# Altium project Archim_2.0a.PrjPcb (part 2 of 3)

## Sheet Motor-X.SchDoc: Motor-X
size Letter; DocumentNumber: 3; SheetNumber: 5; SheetTotal: 11
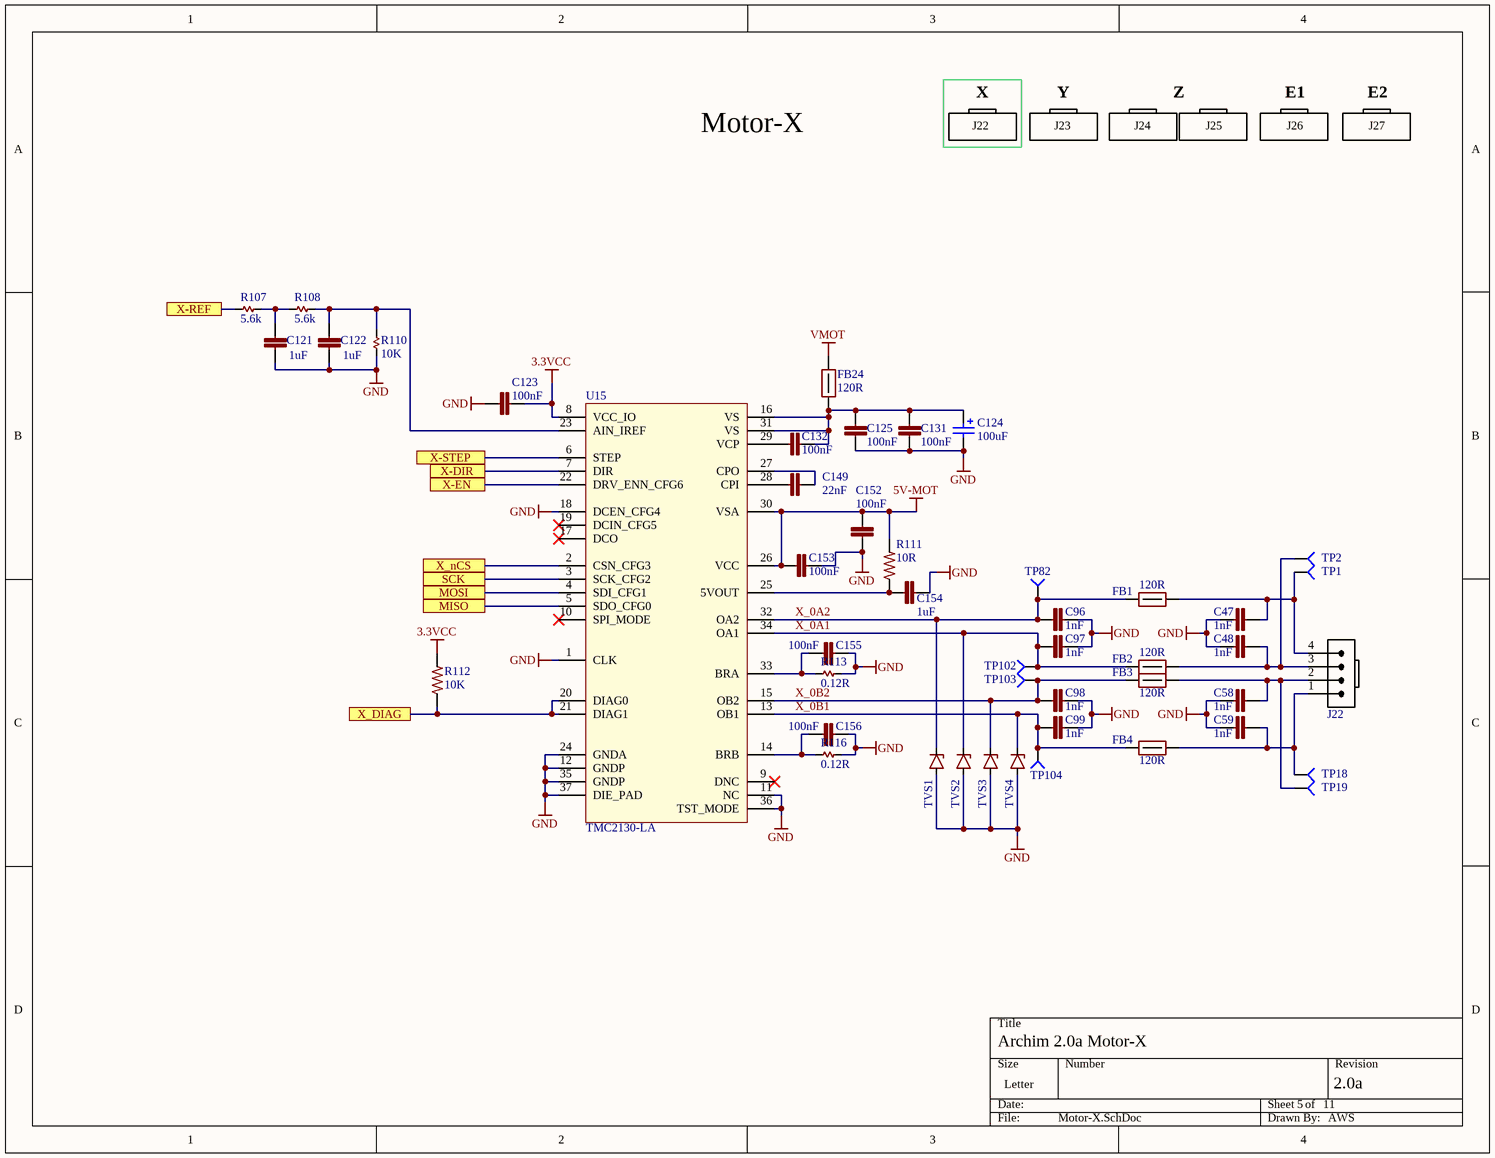
[diagram p6: Motor-X.SchDoc]

### Parts
C47  1nF  [C0402]
C48  1nF  [C0402]
C58  1nF  [C0402]
C59  1nF  [C0402]
C96  1nF  [C0402]
C97  1nF  [C0402]
C98  1nF  [C0402]
C99  1nF  [C0402]
C121  1uF  [C0402]
C122  1uF  [C0402]
C123  100nF  [C0402]
C124  value 100uF  [CAP-ELEC-063063077]  (hidden comment: UWT1V101MCL1GS)
C125  100nF  [C0603]
C131  100nF  [C0603]
C132  100nF  [C0603]
C149  22nF  [C0402]
C152  100nF  [C0402]
C153  100nF  [C0402]
C154  1uF  [C0402]
C155  100nF  [C0603]
C156  100nF  [C0603]
FB1  120R  [FB0603]
FB2  120R  [FB0603]
FB3  120R  [FB0603]
FB4  120R  [FB0603]
FB24  120R  [FB0603]
J22  Molex 0705430038  [4POL254 PIN-IN-PASTE]  (value not drawn)
R107  5.6k  [R0402]
R108  5.6k  [R0402]
R110  10K  [R0402]
R111  10R  [R0402]
R112  10K  [R0402]
R113  0.12R  [R1206]
R116  0.12R  [R1206]
TP1  TP4  [TP-2]  (value not drawn)  (no BOM)
TP2  TP4  [TP-2]  (value not drawn)  (no BOM)
TP18  TP4  [TP-2]  (value not drawn)  (no BOM)
TP19  TP4  [TP-2]  (value not drawn)  (no BOM)
TP82  TP4  [TP-2]  (value not drawn)  (no BOM)
TP102  TP4  [TP-2]  (value not drawn)  (no BOM)
TP103  TP4  [TP-2]  (value not drawn)  (no BOM)
TP104  TP4  [TP-2]  (value not drawn)  (no BOM)
TVS1  TVS 30V SMF  [SMF]  (value not drawn)
TVS2  TVS 30V SMF  [SMF]  (value not drawn)
TVS3  TVS 30V SMF  [SMF]  (value not drawn)
TVS4  TVS 30V SMF  [SMF]  (value not drawn)
U15  TMC2130-LA  [QFN36-50P500X600X900_HS-37N]

### Ports
MISO, MOSI, SCK, X-DIR, X-EN, X-REF, X-STEP, X_DIAG, X_nCS

### Nets
3.3VCC: C123.1 R112.2 U15.8(VCC_IO)
5V-MOT: C152.2 C153.2 R111.2 U15.26(VCC) U15.30(VSA)
GND: C47.1 C48.1 C58.1 C59.1 C96.2 C97.2 C98.2 C99.2 C121.2 C122.2 C123.2 C124.2 C125.1 C131.1 C152.1 C153.1 C154.2 C155.1 C156.1 R110.1 R113.2 R116.2 TVS1.A TVS2.A TVS3.A TVS4.A U15.1(CLK) U15.11(NC) U15.12(GNDP) U15.18(DCEN_CFG4) U15.24(GNDA) U15.35(GNDP) U15.36(TST_MODE) U15.37(DIE_PAD)
VMOT: FB24.2
MISO: U15.5(SDO_CFG0) ; port MISO
MOSI: U15.4(SDI_CFG1) ; port MOSI
SCK: U15.3(SCK_CFG2) ; port SCK
X-DIR: U15.7(DIR) ; port X-DIR
X-EN: U15.22(DRV_ENN_CFG6) ; port X-EN
X-REF: R107.1 ; port X-REF
X-STEP: U15.6(STEP) ; port X-STEP
X_0A1: C97.1 FB2.1 TP102.1 TVS2.K U15.34(OA1)
X_0A2: C96.1 FB1.1 TP82.1 TVS1.K U15.32(OA2)
X_0B1: C99.1 FB4.1 TP104.1 TVS4.K U15.13(OB1)
X_0B2: C98.1 FB3.1 TP103.1 TVS3.K U15.15(OB2)
X_DIAG: R112.1 U15.20(DIAG0) U15.21(DIAG1) ; port X_DIAG
X_nCS: U15.2(CSN_CFG3) ; port X_nCS
NetC47_2: C47.2 FB1.2 J22.4 TP1.1
NetC48_2: C48.2 FB2.2 J22.3 TP2.1
NetC58_2: C58.2 FB3.2 J22.2 TP19.1
NetC59_2: C59.2 FB4.2 J22.1 TP18.1
NetC121_1: C121.1 R107.2 R108.1
NetC122_1: C122.1 R108.2 R110.2 U15.23(AIN_IREF)
NetC124_1: C124.1 C125.2 C131.2 C132.2 FB24.1 U15.16(VS) U15.31(VS)
NetC132_1: C132.1 U15.29(VCP)
NetC149_1: C149.1 U15.28(CPI)
NetC149_2: C149.2 U15.27(CPO)
NetC154_1: C154.1 R111.1 U15.25(5VOUT)
NetC155_2: C155.2 R113.1 U15.33(BRA)
NetC156_2: C156.2 R116.1 U15.14(BRB)

Not connected (* = marked no-connect by the designer): U15 9(DNC)* 10(SPI_MODE)* 17(DCO)* 19(DCIN_CFG5)*

### Notes on the sheet
- X
- Y
- Z
- E1
- E2
- Motor-X
- J22
- J23
- J24
- J25
- J26
- J27

### Library data of the parts
C47 C48 C58 C59 C96-C99 = CAP 1nF 50V 0402 X7R: as C141 on sheet Motor-E1; VALUE: 1nF; DISTRIBUTOR #: 490-1303-2-ND; DISTRIBUTOR: Digi-Key Electronics; EE_SPEC: 50V
C121 C122 = GRM155R60J105KE19D: as C30 on sheet Motor-E1; VALUE: 1uF; MANUFACTURER #: GRM155R60J105KE19D; DISTRIBUTOR #: 490-1320-2-ND; DISTRIBUTOR: Digi-Key Electronics; TOLERANCE: 10%; EE_SPEC: 1uF 6.3V X5R 0402
C123 C152 C153 = GRM155R71C104KA88D: as C85 on sheet Motor-E1; VALUE: 100nF; MANUFACTURER #: GRM155R71C104KA88D; DISTRIBUTOR #: 490-3261-2-ND; DISTRIBUTOR: Digi-Key Electronics; Tolerance: 10%
C124 = UWT1V101MCL1GS: as C87 on sheet Motor-E1; MANUFACTURER #: UWT1V101MCL1GS; DISTRIBUTOR #: 493-2203-2-ND; DISTRIBUTOR: Digi-Key Electronics; Tolerance: 20%
C125 C131 C132 C155 C156 = C0603C104K5RACTU: as C88 on sheet Motor-E1; VALUE: 100nF; MANUFACTURER #: C0603C104K5RACTU; DISTRIBUTOR #: 399-5089-2-ND; DISTRIBUTOR: Digi-Key Electronics; PART: 100nF 50V X7R 0603; Tolerance: 10%
C149 = GCM155R71H223KA55D: as C91 on sheet Motor-E1; VALUE: 22nF; MANUFACTURER #: GCM155R71H223KA55D; DISTRIBUTOR #: 490-4763-2-ND; DISTRIBUTOR: Digi-Key Electronics; PART: 22nF
C154 = GRM155R60J105KE19D: as C102 on sheet Motor-E1; VALUE: 1uF; MANUFACTURER #: GRM155R60J105KE19D; DISTRIBUTOR #: 490-1320-2-ND; DISTRIBUTOR: Digi-Key Electronics; PART: 1uF 6.3V X5R 0402; Tolerance: 10%
FB1-FB4 = FERRITE 120R 3A 0603: as FB26 on sheet Microcontroller; DISTRIBUTOR #: 1276-6351-2-ND; DISTRIBUTOR: Digi-Key Electronics; PART: FERRITE 120R 3A 0603; PART DESCRIPTION: FERRITE BEAD 120 OHM 0603 1LN
FB24 = FERRITE 120R 3A 0603: as FB21 on sheet Motor-E1; DISTRIBUTOR #: 1276-6351-2-ND; DISTRIBUTOR: Digi-Key Electronics; PART: FERRITE 120R 3A 0603; PART DESCRIPTION: FERRITE BEAD 120 OHM 0603 1LN
J22 = Molex 0705430003 PIP: as J26 on sheet Motor-E1
R107 R108 = 5.6k 1% 0402: as R56 on sheet Motor-E1; DISTRIBUTOR #: 311-5.6KLRTR-ND; DISTRIBUTOR: Digi-Key Electronics; PART: RES SMD 5.6K OHM 1% 1/16W 0402; TOLERANCE: 1%; EE_SPEC: 1/16W; VALUE: 5.6k
R110 = 10k 1% 0402: as R58 on sheet Motor-E1; DISTRIBUTOR #: YAG1249TR-ND; DISTRIBUTOR: Digi-Key Electronics; PART: 10k 1% 0402; TOLERANCE: 1%; EE_SPEC: 1/16W; VALUE: 10K
R111 = RC0402FR-0710RL: as R59 on sheet Motor-E1; VALUE: 10R; MANUFACTURER #: RC0402FR-0710RL; DISTRIBUTOR #: 311-10.0LRTR-ND; DISTRIBUTOR: Digi-Key Electronics; PART: 10R; Tolerance: 1%
R112 = RC0402FR-0710KP: as R64 on sheet Microcontroller; VALUE: 10K; MANUFACTURER #: RC0402FR-0710KP; DISTRIBUTOR #: YAG1249TR-ND; DISTRIBUTOR: Digi-Key Electronics; TOLERANCE: 1%; EE_SPEC: 1/16W
R113 R116 = 0.12R 1% 1206: as R84 on sheet Motor-E1; DISTRIBUTOR #: 311-.12LYTR-ND; DISTRIBUTOR: Digi-Key; EE_SPEC: 0.12R 1% 1206; PART: 0.12R; VALUE: 0.12R
TP1 TP2 TP18 TP19 TP82 TP102-TP104 = Socket: MANUFACTURER #: NOTAPART-Testpoint
TVS1-TVS4 = TVS 30V SMF: TVS DIODE 30VWM 48.4VC SMF; MANUFACTURER: Vishay; MANUFACTURER #: SMF30A-E3-08; PART: TVS Diode 48.4VC; TOLERANCE: -NA-; EE_SPEC: 30Vrs 48.4Vc; DISTRIBUTOR #: SMF30A-E3-08GITR-ND; DISTRIBUTOR: Digi-Key Electronics; PART DESCRIPTION: TVS DIODE 30VWM 48.4VC SMF
U15 = TMC2130-LA-T: as U13 on sheet Motor-E1; DISTRIBUTOR #: 1460-1130-2-ND; DISTRIBUTOR: Digi-Key Electronics; MANUFACTURER #: TMC2130-LA-T; PART: TMC2130; VALUE: TMC2130

## Sheet Motor-Y.SchDoc: Motor-Y
size Letter; DocumentNumber: 3; SheetNumber: 6; SheetTotal: 11
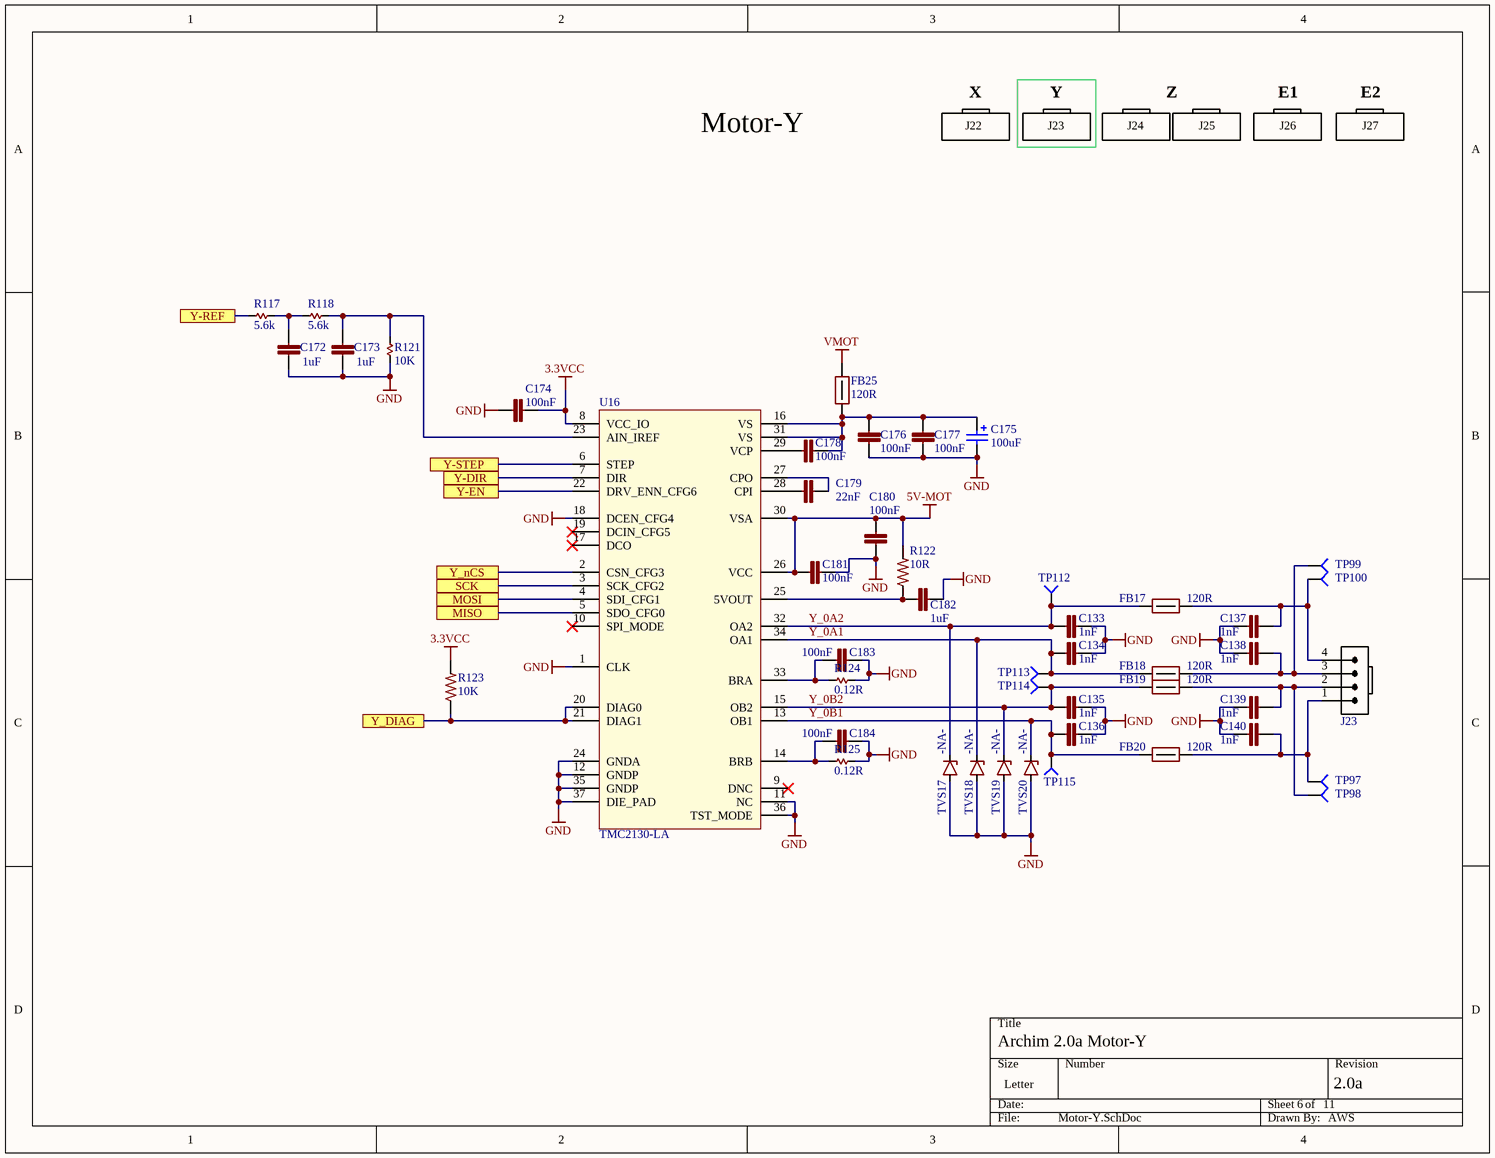
[diagram p7: Motor-Y.SchDoc]

### Parts
C133  1nF  [C0402]
C134  1nF  [C0402]
C135  1nF  [C0402]
C136  1nF  [C0402]
C137  1nF  [C0402]
C138  1nF  [C0402]
C139  1nF  [C0402]
C140  1nF  [C0402]
C172  1uF  [C0402]
C173  1uF  [C0402]
C174  100nF  [C0402]
C175  value 100uF  [CAP-ELEC-063063077]  (hidden comment: UWT1V101MCL1GS)
C176  100nF  [C0603]
C177  100nF  [C0603]
C178  100nF  [C0603]
C179  22nF  [C0402]
C180  100nF  [C0402]
C181  100nF  [C0402]
C182  1uF  [C0402]
C183  100nF  [C0603]
C184  100nF  [C0603]
FB17  120R  [FB0603]
FB18  120R  [FB0603]
FB19  120R  [FB0603]
FB20  120R  [FB0603]
FB25  120R  [FB0603]
J23  Molex 0705430038  [4POL254 PIN-IN-PASTE]  (value not drawn)
R117  5.6k  [R0402]
R118  5.6k  [R0402]
R121  10K  [R0402]
R122  10R  [R0402]
R123  10K  [R0402]
R124  0.12R  [R1206]
R125  0.12R  [R1206]
TP97  TP4  [TP-2]  (value not drawn)  (no BOM)
TP98  TP4  [TP-2]  (value not drawn)  (no BOM)
TP99  TP4  [TP-2]  (value not drawn)  (no BOM)
TP100  TP4  [TP-2]  (value not drawn)  (no BOM)
TP112  TP4  [TP-2]  (value not drawn)  (no BOM)
TP113  TP4  [TP-2]  (value not drawn)  (no BOM)
TP114  TP4  [TP-2]  (value not drawn)  (no BOM)
TP115  TP4  [TP-2]  (value not drawn)  (no BOM)
TVS17  value -NA-  [SMF]  (hidden comment: TVS 30V SMF)
TVS18  value -NA-  [SMF]  (hidden comment: TVS 30V SMF)
TVS19  value -NA-  [SMF]  (hidden comment: TVS 30V SMF)
TVS20  value -NA-  [SMF]  (hidden comment: TVS 30V SMF)
U16  TMC2130-LA  [QFN36-50P500X600X900_HS-37N]

### Ports
MISO, MOSI, SCK, Y-DIR, Y-EN, Y-REF, Y-STEP, Y_DIAG, Y_nCS

### Nets
3.3VCC: C174.1 R123.2 U16.8(VCC_IO)
5V-MOT: C180.2 C181.2 R122.2 U16.26(VCC) U16.30(VSA)
GND: C133.2 C134.2 C135.2 C136.2 C137.2 C138.2 C139.2 C140.2 C172.2 C173.2 C174.2 C175.2 C176.1 C177.1 C180.1 C181.1 C182.2 C183.1 C184.1 R121.1 R124.2 R125.2 TVS17.A TVS18.A TVS19.A TVS20.A U16.1(CLK) U16.11(NC) U16.12(GNDP) U16.18(DCEN_CFG4) U16.24(GNDA) U16.35(GNDP) U16.36(TST_MODE) U16.37(DIE_PAD)
VMOT: FB25.2
MISO: U16.5(SDO_CFG0) ; port MISO
MOSI: U16.4(SDI_CFG1) ; port MOSI
SCK: U16.3(SCK_CFG2) ; port SCK
Y-DIR: U16.7(DIR) ; port Y-DIR
Y-EN: U16.22(DRV_ENN_CFG6) ; port Y-EN
Y-REF: R117.1 ; port Y-REF
Y-STEP: U16.6(STEP) ; port Y-STEP
Y_0A1: C134.1 FB18.1 TP113.1 TVS18.K U16.34(OA1)
Y_0A2: C133.1 FB17.1 TP112.1 TVS17.K U16.32(OA2)
Y_0B1: C136.1 FB20.1 TP115.1 TVS20.K U16.13(OB1)
Y_0B2: C135.1 FB19.1 TP114.1 TVS19.K U16.15(OB2)
Y_DIAG: R123.1 U16.20(DIAG0) U16.21(DIAG1) ; port Y_DIAG
Y_nCS: U16.2(CSN_CFG3) ; port Y_nCS
NetC137_1: C137.1 FB17.2 J23.4 TP100.1
NetC138_1: C138.1 FB18.2 J23.3 TP99.1
NetC139_1: C139.1 FB19.2 J23.2 TP98.1
NetC140_1: C140.1 FB20.2 J23.1 TP97.1
NetC172_1: C172.1 R117.2 R118.1
NetC173_1: C173.1 R118.2 R121.2 U16.23(AIN_IREF)
NetC175_1: C175.1 C176.2 C177.2 C178.2 FB25.1 U16.16(VS) U16.31(VS)
NetC178_1: C178.1 U16.29(VCP)
NetC179_1: C179.1 U16.28(CPI)
NetC179_2: C179.2 U16.27(CPO)
NetC182_1: C182.1 R122.1 U16.25(5VOUT)
NetC183_2: C183.2 R124.1 U16.33(BRA)
NetC184_2: C184.2 R125.1 U16.14(BRB)

Not connected (* = marked no-connect by the designer): U16 9(DNC)* 10(SPI_MODE)* 17(DCO)* 19(DCIN_CFG5)*

### Notes on the sheet
- X
- Y
- Z
- E1
- E2
- Motor-Y
- J22
- J23
- J24
- J25
- J26
- J27

### Library data of the parts
C133-C140 = CAP 1nF 50V 0402 X7R: as C141 on sheet Motor-E1; VALUE: 1nF; DISTRIBUTOR #: 490-1303-2-ND; DISTRIBUTOR: Digi-Key Electronics; EE_SPEC: 50V
C172 C173 = GRM155R60J105KE19D: as C30 on sheet Motor-E1; VALUE: 1uF; MANUFACTURER #: GRM155R60J105KE19D; DISTRIBUTOR #: 490-1320-2-ND; DISTRIBUTOR: Digi-Key Electronics; TOLERANCE: 10%; EE_SPEC: 1uF 6.3V X5R 0402
C174 C180 C181 = GRM155R71C104KA88D: as C85 on sheet Motor-E1; VALUE: 100nF; MANUFACTURER #: GRM155R71C104KA88D; DISTRIBUTOR #: 490-3261-2-ND; DISTRIBUTOR: Digi-Key Electronics; Tolerance: 10%
C175 = UWT1V101MCL1GS: as C87 on sheet Motor-E1; MANUFACTURER #: UWT1V101MCL1GS; DISTRIBUTOR #: 493-2203-2-ND; DISTRIBUTOR: Digi-Key Electronics; Tolerance: 20%
C176-C178 C183 C184 = C0603C104K5RACTU: as C88 on sheet Motor-E1; VALUE: 100nF; MANUFACTURER #: C0603C104K5RACTU; DISTRIBUTOR #: 399-5089-2-ND; DISTRIBUTOR: Digi-Key Electronics; PART: 100nF 50V X7R 0603; Tolerance: 10%
C179 = GCM155R71H223KA55D: as C91 on sheet Motor-E1; VALUE: 22nF; MANUFACTURER #: GCM155R71H223KA55D; DISTRIBUTOR #: 490-4763-2-ND; DISTRIBUTOR: Digi-Key Electronics; PART: 22nF
C182 = GRM155R60J105KE19D: as C102 on sheet Motor-E1; VALUE: 1uF; MANUFACTURER #: GRM155R60J105KE19D; DISTRIBUTOR #: 490-1320-2-ND; DISTRIBUTOR: Digi-Key Electronics; PART: 1uF 6.3V X5R 0402; Tolerance: 10%
FB17-FB20 = FERRITE 120R 3A 0603: as FB26 on sheet Microcontroller; DISTRIBUTOR #: 1276-6351-2-ND; DISTRIBUTOR: Digi-Key Electronics; PART: FERRITE 120R 3A 0603; PART DESCRIPTION: FERRITE BEAD 120 OHM 0603 1LN
FB25 = FERRITE 120R 3A 0603: as FB21 on sheet Motor-E1; DISTRIBUTOR #: 1276-6351-2-ND; DISTRIBUTOR: Digi-Key Electronics; PART: FERRITE 120R 3A 0603; PART DESCRIPTION: FERRITE BEAD 120 OHM 0603 1LN
J23 = Molex 0705430003 PIP: as J26 on sheet Motor-E1
R117 R118 = 5.6k 1% 0402: as R56 on sheet Motor-E1; DISTRIBUTOR #: 311-5.6KLRTR-ND; DISTRIBUTOR: Digi-Key Electronics; PART: RES SMD 5.6K OHM 1% 1/16W 0402; TOLERANCE: 1%; EE_SPEC: 1/16W; VALUE: 5.6k
R121 = 10k 1% 0402: as R58 on sheet Motor-E1; DISTRIBUTOR #: YAG1249TR-ND; DISTRIBUTOR: Digi-Key Electronics; PART: 10k 1% 0402; TOLERANCE: 1%; EE_SPEC: 1/16W; VALUE: 10K
R122 = RC0402FR-0710RL: as R59 on sheet Motor-E1; VALUE: 10R; MANUFACTURER #: RC0402FR-0710RL; DISTRIBUTOR #: 311-10.0LRTR-ND; DISTRIBUTOR: Digi-Key Electronics; PART: 10R; Tolerance: 1%
R123 = RC0402FR-0710KP: as R64 on sheet Microcontroller; VALUE: 10K; MANUFACTURER #: RC0402FR-0710KP; DISTRIBUTOR #: YAG1249TR-ND; DISTRIBUTOR: Digi-Key Electronics; TOLERANCE: 1%; EE_SPEC: 1/16W
R124 R125 = 0.12R 1% 1206: as R84 on sheet Motor-E1; DISTRIBUTOR #: 311-.12LYTR-ND; DISTRIBUTOR: Digi-Key; EE_SPEC: 0.12R 1% 1206; PART: 0.12R; VALUE: 0.12R
TP97-TP100 TP112-TP115 = Socket: MANUFACTURER #: NOTAPART-Testpoint
TVS17-TVS20 = TVS 30V SMF: as TVS13 on sheet Motor-E1; DISTRIBUTOR #: SMF30A-E3-08GITR-ND; DISTRIBUTOR: Digi-Key Electronics; PART DESCRIPTION: TVS DIODE 30VWM 48.4VC SMF; TOLERANCE: -NA-
U16 = TMC2130-LA-T: as U13 on sheet Motor-E1; DISTRIBUTOR #: 1460-1130-2-ND; DISTRIBUTOR: Digi-Key Electronics; MANUFACTURER #: TMC2130-LA-T; PART: TMC2130; VALUE: TMC2130

## Sheet Motor-Z.SchDoc: Motor-Z
size Letter; DocumentNumber: 4; SheetNumber: 7; SheetTotal: 11
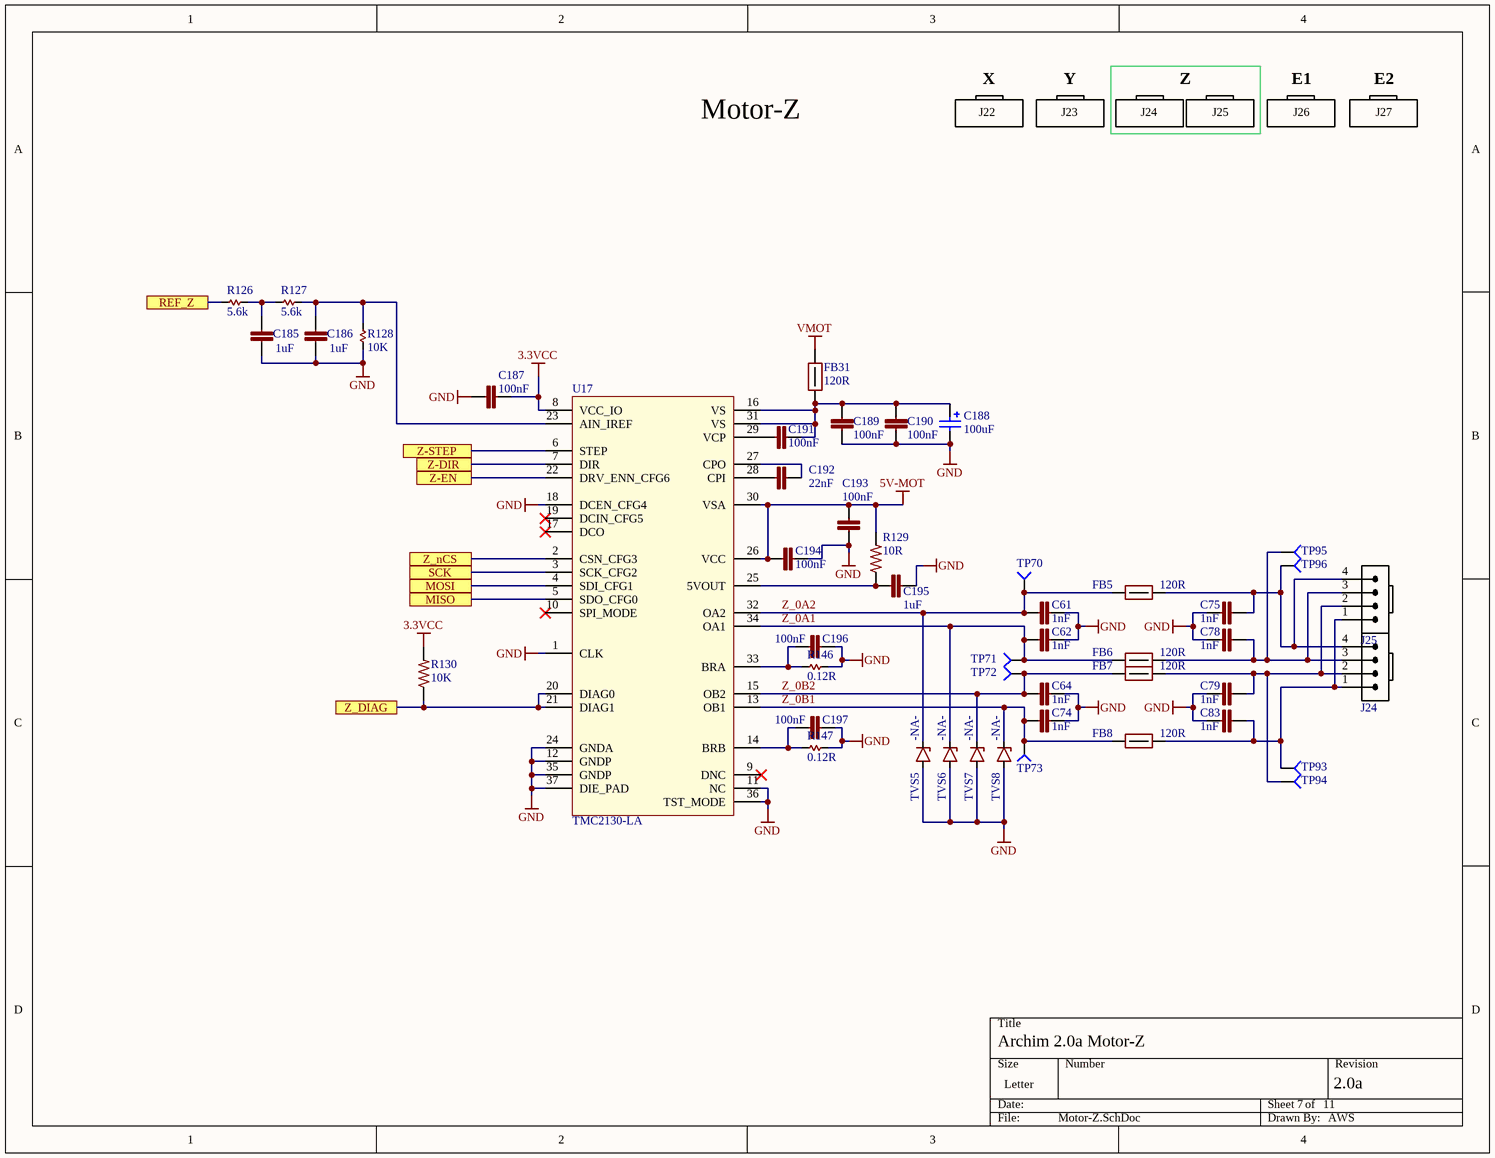
[diagram p8: Motor-Z.SchDoc]

### Parts
C61  1nF  [C0402]
C62  1nF  [C0402]
C64  1nF  [C0402]
C74  1nF  [C0402]
C75  1nF  [C0402]
C78  1nF  [C0402]
C79  1nF  [C0402]
C83  1nF  [C0402]
C185  1uF  [C0402]
C186  1uF  [C0402]
C187  100nF  [C0402]
C188  value 100uF  [CAP-ELEC-063063077]  (hidden comment: UWT1V101MCL1GS)
C189  100nF  [C0603]
C190  100nF  [C0603]
C191  100nF  [C0603]
C192  22nF  [C0402]
C193  100nF  [C0402]
C194  100nF  [C0402]
C195  1uF  [C0402]
C196  100nF  [C0603]
C197  100nF  [C0603]
FB5  120R  [FB0603]
FB6  120R  [FB0603]
FB7  120R  [FB0603]
FB8  120R  [FB0603]
FB31  120R  [FB0603]
J24  Molex 0705430038  [4POL254 PIN-IN-PASTE]  (value not drawn)
J25  Molex 0705430038  [4POL254 PIN-IN-PASTE]  (value not drawn)
R126  5.6k  [R0402]
R127  5.6k  [R0402]
R128  10K  [R0402]
R129  10R  [R0402]
R130  10K  [R0402]
R146  0.12R  [R1206]
R147  0.12R  [R1206]
TP70  TP4  [TP-2]  (value not drawn)  (no BOM)
TP71  TP4  [TP-2]  (value not drawn)  (no BOM)
TP72  TP4  [TP-2]  (value not drawn)  (no BOM)
TP73  TP4  [TP-2]  (value not drawn)  (no BOM)
TP93  TP4  [TP-2]  (value not drawn)  (no BOM)
TP94  TP4  [TP-2]  (value not drawn)  (no BOM)
TP95  TP4  [TP-2]  (value not drawn)  (no BOM)
TP96  TP4  [TP-2]  (value not drawn)  (no BOM)
TVS5  value -NA-  [SMF]  (hidden comment: TVS 30V SMF)
TVS6  value -NA-  [SMF]  (hidden comment: TVS 30V SMF)
TVS7  value -NA-  [SMF]  (hidden comment: TVS 30V SMF)
TVS8  value -NA-  [SMF]  (hidden comment: TVS 30V SMF)
U17  TMC2130-LA  [QFN36-50P500X600X900_HS-37N]

### Ports
MISO, MOSI, REF_Z, SCK, Z-DIR, Z-EN, Z-STEP, Z_DIAG, Z_nCS

### Nets
3.3VCC: C187.1 R130.2 U17.8(VCC_IO)
5V-MOT: C193.2 C194.2 R129.2 U17.26(VCC) U17.30(VSA)
GND: C61.2 C62.2 C64.2 C74.2 C75.1 C78.1 C79.1 C83.1 C185.2 C186.2 C187.2 C188.2 C189.1 C190.1 C193.1 C194.1 C195.2 C196.1 C197.1 R128.1 R146.2 R147.2 TVS5.A TVS6.A TVS7.A TVS8.A U17.1(CLK) U17.11(NC) U17.12(GNDP) U17.18(DCEN_CFG4) U17.24(GNDA) U17.35(GNDP) U17.36(TST_MODE) U17.37(DIE_PAD)
VMOT: FB31.2
MISO: U17.5(SDO_CFG0) ; port MISO
MOSI: U17.4(SDI_CFG1) ; port MOSI
REF_Z: R126.1 ; port REF_Z
SCK: U17.3(SCK_CFG2) ; port SCK
Z-DIR: U17.7(DIR) ; port Z-DIR
Z-EN: U17.22(DRV_ENN_CFG6) ; port Z-EN
Z-STEP: U17.6(STEP) ; port Z-STEP
Z_0A1: C62.1 FB6.1 TP71.1 TVS6.K U17.34(OA1)
Z_0A2: C61.1 FB5.1 TP70.1 TVS5.K U17.32(OA2)
Z_0B1: C74.1 FB8.1 TP73.1 TVS8.K U17.13(OB1)
Z_0B2: C64.1 FB7.1 TP72.1 TVS7.K U17.15(OB2)
Z_DIAG: R130.1 U17.20(DIAG0) U17.21(DIAG1) ; port Z_DIAG
Z_nCS: U17.2(CSN_CFG3) ; port Z_nCS
NetC75_2: C75.2 FB5.2 J24.4 J25.4 TP96.1
NetC78_2: C78.2 FB6.2 J24.3 J25.3 TP95.1
NetC79_2: C79.2 FB7.2 J24.2 J25.2 TP94.1
NetC83_2: C83.2 FB8.2 J24.1 J25.1 TP93.1
NetC185_1: C185.1 R126.2 R127.1
NetC186_1: C186.1 R127.2 R128.2 U17.23(AIN_IREF)
NetC188_1: C188.1 C189.2 C190.2 C191.2 FB31.1 U17.16(VS) U17.31(VS)
NetC191_1: C191.1 U17.29(VCP)
NetC192_1: C192.1 U17.28(CPI)
NetC192_2: C192.2 U17.27(CPO)
NetC195_1: C195.1 R129.1 U17.25(5VOUT)
NetC196_2: C196.2 R146.1 U17.33(BRA)
NetC197_2: C197.2 R147.1 U17.14(BRB)

Not connected (* = marked no-connect by the designer): U17 9(DNC)* 10(SPI_MODE)* 17(DCO)* 19(DCIN_CFG5)*

### Notes on the sheet
- X
- Y
- Z
- E1
- E2
- Motor-Z
- J22
- J23
- J24
- J25
- J26
- J27

### Library data of the parts
C61 C62 C64 C74 C75 C78 C79 C83 = CAP 1nF 50V 0402 X7R: 1000pF 50V Ceramic Capacitor X7R 0402 (1005 Metric) 0.039" L x 0.020" W (1.00mm x 0.50mm); MANUFACTURER: Murata; MANUFACTURER #: GRM155R71H102KA01D; PART: 1nF 50V X7R 0402; PART DESCRIPTION: 1000pF ±10% 50V Ceramic Capacitor X7R 0402 (1005 Metric); TOLERANCE: 10%; VALUE: 1nF; DISTRIBUTOR #: 490-1303-2-ND; DISTRIBUTOR: Digi-Key Electronics; EE_SPEC: 50V
C185 C186 = GRM155R60J105KE19D: CAP CER 0402 1uF 6.3V 10% X5R; MANUFACTURER: Murata; PART: 1uF 6.3V X5R 0402; PART DESCRIPTION: 1µF ±10% 6.3V Ceramic Capacitor X5R 0402 (1005 Metric); VALUE: 1uF; MANUFACTURER #: GRM155R60J105KE19D; DISTRIBUTOR #: 490-1320-2-ND; DISTRIBUTOR: Digi-Key Electronics; TOLERANCE: 10%; EE_SPEC: 1uF 6.3V X5R 0402
C187 C193 C194 = GRM155R71C104KA88D: CAP CER 0402 100nF 16V 10% X7R; Manufacturer: Murata; PART: 0.1uF 16V X7R 0402; Part Description: 0.10µF ±10% 16V Ceramic Capacitor X7R 0402 (1005 Metric); EE_SPEC: 100nF 16V X7R 0402; VALUE: 100nF; MANUFACTURER #: GRM155R71C104KA88D; DISTRIBUTOR #: 490-3261-2-ND; DISTRIBUTOR: Digi-Key Electronics; Tolerance: 10%
C188 = UWT1V101MCL1GS: CAP ALUM 100UF 35V 20% SMD; Manufacturer: Nichicon; PART: 100uF 35V SMD Al-El; Part Description: 100µF 35V Aluminum Capacitors Radial, Can - SMD 1000 Hrs @ 105°C; EE_SPEC: 100uF 35V Al-El; MANUFACTURER #: UWT1V101MCL1GS; DISTRIBUTOR #: 493-2203-2-ND; DISTRIBUTOR: Digi-Key Electronics; Tolerance: 20%
C189-C191 C196 C197 = C0603C104K5RACTU: CAP CER 0603 100nF 50V 10% X7R; Manufacturer: Kemet; Part Description: 0.1µF ±10% 50V Ceramic Capacitor X7R 0603 (1608 Metric); EE_SPEC: 100nF 50V X7R 0603; VALUE: 100nF; MANUFACTURER #: C0603C104K5RACTU; DISTRIBUTOR #: 399-5089-2-ND; DISTRIBUTOR: Digi-Key Electronics; PART: 100nF 50V X7R 0603; Tolerance: 10%
C192 = GCM155R71H223KA55D: CAP CER 0402 22nF ±10% 50V X7R; Manufacturer: YAGEO; Part Description: 0.022µF ±10% 50V Ceramic Capacitor X7R 0402 (1005 Metric); EE_SPEC: 22nF 50V X7R 0402; Tolerance: +/- 10%; VALUE: 22nF; MANUFACTURER #: GCM155R71H223KA55D; DISTRIBUTOR #: 490-4763-2-ND; DISTRIBUTOR: Digi-Key Electronics; PART: 22nF
C195 = GRM155R60J105KE19D: CAP CER 0402 1uF 6.3V 10% X5R; Manufacturer: Murata; Part Description: 1µF ±10% 6.3V Ceramic Capacitor X5R 0402 (1005 Metric); EE_SPEC: 1uF 6.3V X5R 0402; VALUE: 1uF; MANUFACTURER #: GRM155R60J105KE19D; DISTRIBUTOR #: 490-1320-2-ND; DISTRIBUTOR: Digi-Key Electronics; PART: 1uF 6.3V X5R 0402; Tolerance: 10%
FB5-FB8 = FERRITE 120R 3A 0603: FERRITE BEAD 120 OHM 0603 1LN; MANUFACTURER: Samsung; MANUFACTURER #: CIS10P121AC; MANUFACTURER2#: 490-5254-2-ND; VALUE: 120Rfb; TOLERANCE: -NA-; EE_SPEC: 3A; DISTRIBUTOR #: 1276-6351-2-ND; DISTRIBUTOR: Digi-Key Electronics; PART: FERRITE 120R 3A 0603; PART DESCRIPTION: FERRITE BEAD 120 OHM 0603 1LN
FB31 = FERRITE 120R 3A 0603: FERRITE BEAD 120 OHM 0603 1LN; MANUFACTURER: Samsung; MANUFACTURER #: CIS10P121AC; VALUE: 120Rfb; TOLERANCE: -NA-; EE_SPEC: 3A; DISTRIBUTOR #: 1276-6351-2-ND; DISTRIBUTOR: Digi-Key Electronics; PART: FERRITE 120R 3A 0603; PART DESCRIPTION: FERRITE BEAD 120 OHM 0603 1LN
J24 J25 = Molex 0705430003 PIP: Molex 4 Pin Clip Connector - Pin In Paste footprint
R126 R127 = 5.6k 1% 0402: RES SMD 5.6K OHM 1% 1/16W 0402; MANUFACTURER: YAGEO; MANUFACTURER #: RC0402FR-075K6L; PART DESCRIPTION: ±1% 0.063W, 1/16W Chip Resistor 0402 (1005 Metric) Moisture Resistant Thick Film; DISTRIBUTOR #: 311-5.6KLRTR-ND; DISTRIBUTOR: Digi-Key Electronics; PART: RES SMD 5.6K OHM 1% 1/16W 0402; TOLERANCE: 1%; EE_SPEC: 1/16W; VALUE: 5.6k
R128 = 10k 1% 0402: RES SMD 10K OHM 1% 1/16W 0402; MANUFACTURER: Yageo; MANUFACTURER #: RC0402FR-0710KP; PART DESCRIPTION: 10k Ohm ±1% 0.063W, 1/16W Chip Resistor 0402 (1005 Metric) Moisture Resistant Thick Film; DISTRIBUTOR #: YAG1249TR-ND; DISTRIBUTOR: Digi-Key Electronics; PART: 10k 1% 0402; TOLERANCE: 1%; EE_SPEC: 1/16W; VALUE: 10K
R129 = RC0402FR-0710RL: RES SMD 10 OHM 1% 1/16W 0402; Manufacturer: Yageo; Part Description: 10 Ohm ±1% 0.063W, 1/16W Chip Resistor 0402 (1005 Metric) Moisture Resistant Thick Film; EE_SPEC: 10R 1% 0402; VALUE: 10R; MANUFACTURER #: RC0402FR-0710RL; DISTRIBUTOR #: 311-10.0LRTR-ND; DISTRIBUTOR: Digi-Key Electronics; PART: 10R; Tolerance: 1%
R130 = RC0402FR-0710KP: RES SMD 10K OHM 1% 1/16W 0402; MANUFACTURER: Yageo; PART: 10k 1% 0402; PART DESCRIPTION: 10k Ohm ±1% 0.063W, 1/16W Chip Resistor 0402 (1005 Metric) Moisture Resistant Thick Film; VALUE: 10K; MANUFACTURER #: RC0402FR-0710KP; DISTRIBUTOR #: YAG1249TR-ND; DISTRIBUTOR: Digi-Key Electronics; TOLERANCE: 1%; EE_SPEC: 1/16W
R146 R147 = 0.12R 1% 1206: RES 0.12 OHM 1% 1/2W 1206; MANUFACTURER #: RL1206FR-7W0R12L; Part Description: 120 mOhms ±1% 0.5W, 1/2W Chip Resistor 1206 (3216 Metric) Automotive AEC-Q200, Current Sense, Moisture Resistant Thick Film; Tolerance: +/- 1%; DISTRIBUTOR #: 311-.12LYTR-ND; DISTRIBUTOR: Digi-Key; EE_SPEC: 0.12R 1% 1206; PART: 0.12R; VALUE: 0.12R
TP70-TP73 TP93-TP96 = Socket: MANUFACTURER #: NOTAPART-Testpoint
TVS5-TVS8 = TVS 30V SMF: TVS DIODE 30VWM 48.4VC SMF; MANUFACTURER: Vishay; MANUFACTURER #: SMF30A-E3-08; PART: TVS Diode 48.4VC; EE_SPEC: 30Vrs 48.4Vc; DISTRIBUTOR #: SMF30A-E3-08GITR-ND; DISTRIBUTOR: Digi-Key Electronics; PART DESCRIPTION: TVS DIODE 30VWM 48.4VC SMF; TOLERANCE: -NA-
U17 = TMC2130-LA-T: IC STEPPER MOTOR DVR SPI 36QFN; Manufacturer: Trinamic; Part Description: Bipolar Motor Driver Power MOSFET SPI, Step/Direction 36-QFN (5x6); EE_SPEC: 46V 1.2A 1/256 Step; Tolerance: NA; DISTRIBUTOR #: 1460-1130-2-ND; DISTRIBUTOR: Digi-Key Electronics; MANUFACTURER #: TMC2130-LA-T; PART: TMC2130; VALUE: TMC2130

## Sheet Power.SchDoc: Power
size Letter; DocumentNumber: 8; SheetNumber: 2; SheetTotal: 11
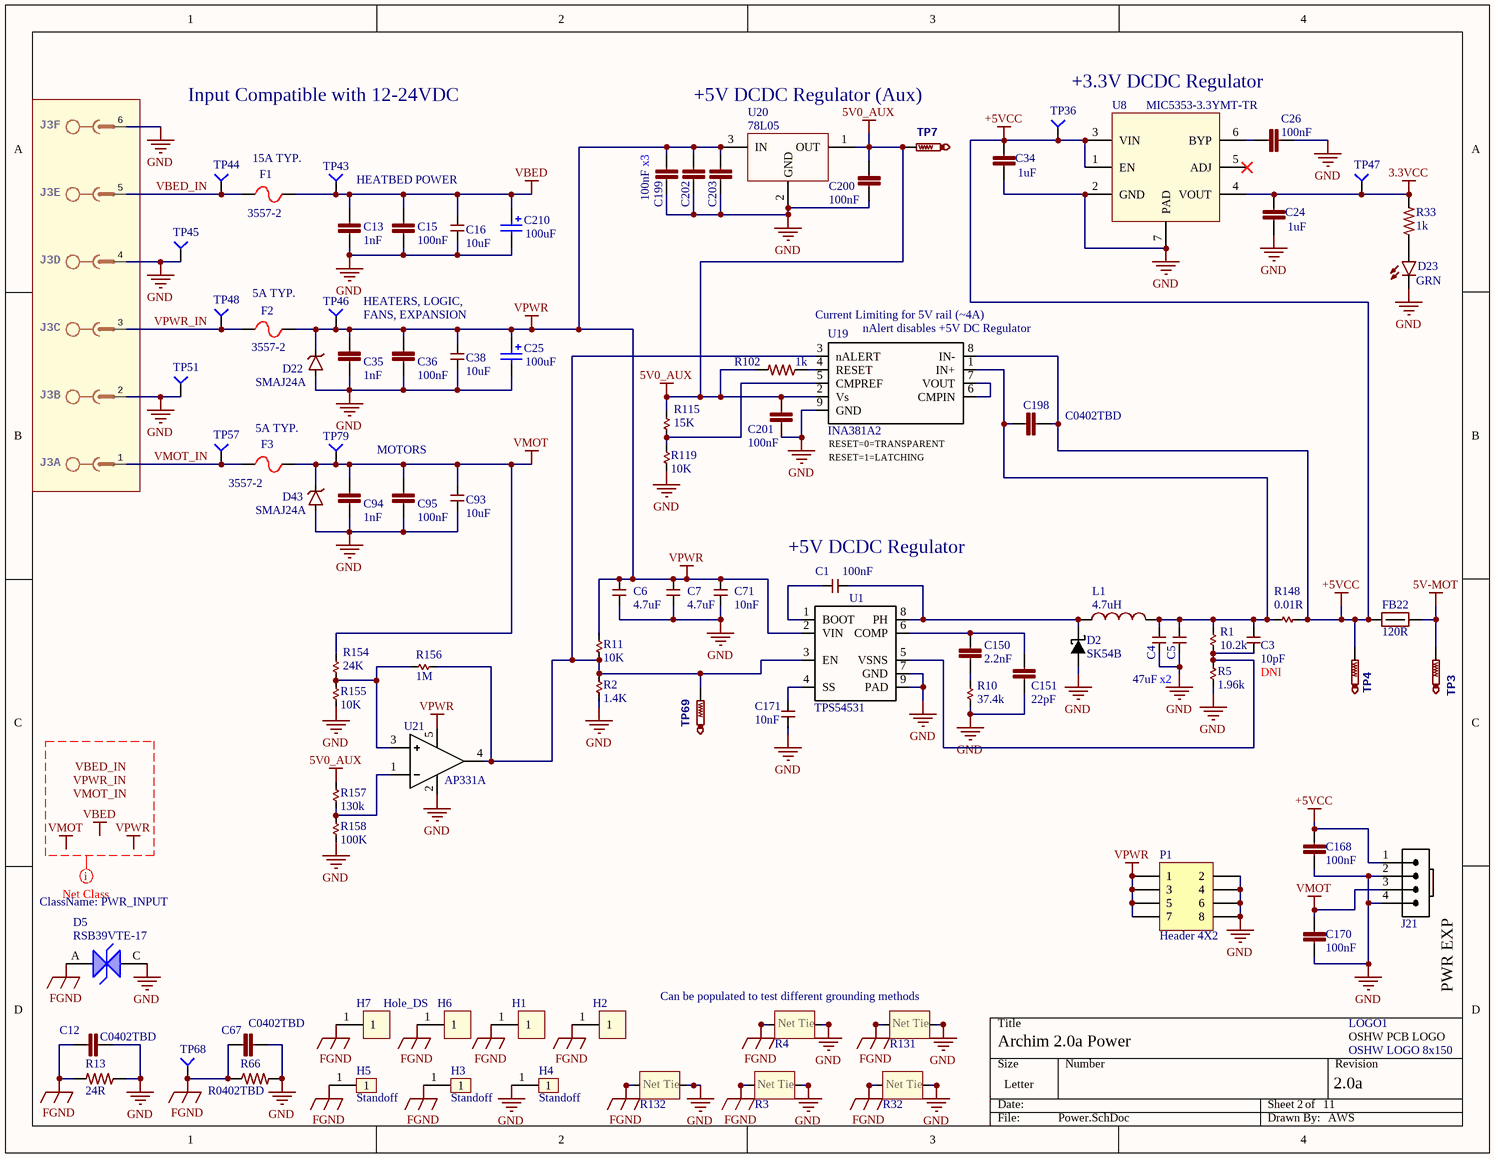
[diagram p9: Power.SchDoc]

### Parts
C1  100nF  [C0603]
C3  10pF  [C0402]
C4  47uF  [C1210]
C5  47uF  [C1210]  (value not drawn)
C6  4.7uF  [C1210]
C7  4.7uF  [C1210]
C12  C0402TBD  [C0402]
C13  1nF  [C0402]
C15  100nF  [C0603]
C16  10uF  [C1206]
C24  1uF  [C0402]
C25  value 100uF  [CAP-ELEC-063063077]  (hidden comment: UWT1V101MCL1GS)
C26  100nF  [C0402]
C34  1uF  [C0402]
C35  1nF  [C0402]
C36  100nF  [C0603]
C38  10uF  [C1206]
C67  C0402TBD  [C0402]
C71  10nF  [C0402]
C93  10uF  [C1206]
C94  1nF  [C0402]
C95  100nF  [C0603]
C150  2.2nF  [C0402]
C151  22pF  [C0402]
C168  100nF  [C0402]
C170  100nF  [C0402]
C171  10nF  [C0402]
C198  C0402TBD  [C0402]
C199  100nF  [C0603]
C200  100nF  [C0402]
C201  100nF  [C0402]
C202  100nF  [C0603]  (value not drawn)
C203  100nF  [C0603]  (value not drawn)
C210  value 100uF  [CAP-ELEC-063063077]  (hidden comment: UWT1V101MCL1GS)
D2  SK54B  [SMB_DO-214AA_LRG]
D5  RSB39VTE-17  [SOD323-R]
D22  SMAJ24A  [SMA-SM]
D23  GRN  [LED2012120]
D43  SMAJ24A  [SMA-SM]
F1  3557-2  [3557]
F2  3557-2  [3557]
F3  3557-2  [3557]
FB22  120R  [FB0603]
H1  Hole_DS  [Wave_hole_3x7-doubleSided]  (value not drawn)  (no BOM)
H2  Hole_DS  [Wave_hole_3x7-doubleSided]  (value not drawn)  (no BOM)
H3  Standoff  [Standoff3mmTopConn]  (no BOM)
H4  Standoff  [Standoff3mmTopConn]  (no BOM)
H5  Standoff  [Standoff3mmTopConn]  (no BOM)
H6  Hole_DS  [Wave_hole_3x7-doubleSided]  (value not drawn)  (no BOM)
H7  Hole_DS  [Wave_hole_3x7-doubleSided]  (no BOM)
J3  MSTBH6  [MSTBH6]  (value not drawn)  (parts A,B,C,D,E,F of 6)
J21  Molex 0705430038  [4POL254 PIN-IN-PASTE]  (value not drawn)
L1  4.7uH  [IND_10X10]
LOGO1  OSHW LOGO 8x150  [OSHW_8X150_NOTEXT]  (no BOM)
P1  Header 4X2  [HDR2X4]
R1  10.2k  [R0402]
R2  1.4K  [R0402]
R3  Net-Tie 0402  [Net Tie - R0402]  (value not drawn)  (net tie)
R4  Net-Tie 0402  [Net Tie - R0402]  (value not drawn)  (net tie)
R5  1.96k  [R0402]
R10  37.4k  [R0402]
R11  10K  [R0402]
R13  24R  [R0402]
R32  Net-Tie 0402  [Net Tie - R0402]  (value not drawn)  (net tie)
R33  1k  [R0402]
R66  R0402TBD  [R0402]
R102  1k  [R0402]
R115  15K  [R0402]
R119  10K  [R0402]
R131  Net-Tie 0402  [Net Tie - R0402]  (value not drawn)  (net tie)
R132  Net-Tie 0402  [Net Tie - R0402]  (value not drawn)  (net tie)
R148  0.01R  [R0805]
R154  24K  [R0402]
R155  10K  [R0402]
R156  1M  [R0402]
R157  130k  [R0402]
R158  100K  [R0402]
TP3  TestPoint  [TP1-27]  (value not drawn)  (no BOM)
TP4  TestPoint  [TP1-27]  (value not drawn)  (no BOM)
TP7  TestPoint  [TP1-27]  (value not drawn)  (no BOM)
TP36  TP4  [TP-2]  (value not drawn)  (no BOM)
TP43  TP4  [TP-2]  (value not drawn)  (no BOM)
TP44  TP4  [TP-2]  (value not drawn)  (no BOM)
TP45  TP4  [TP-2]  (value not drawn)  (no BOM)
TP46  TP4  [TP-2]  (value not drawn)  (no BOM)
TP47  TP4  [TP-2]  (value not drawn)  (no BOM)
TP48  TP4  [TP-2]  (value not drawn)  (no BOM)
TP51  TP4  [TP-2]  (value not drawn)  (no BOM)
TP57  TP4  [TP-2]  (value not drawn)  (no BOM)
TP68  TP4  [TP-2]  (value not drawn)  (no BOM)
TP69  TestPoint  [TP1-27]  (value not drawn)  (no BOM)
TP79  TP4  [TP-2]  (value not drawn)  (no BOM)
U1  TPS54531  [SOIC127P600X170_HS-9L]
U8  MIC5353-3.3YMT-TR  [TDFN1616-6LD-PL-1]
U19  INA381A2  [WSON8_2x2mm]
U20  78L05  [SOT-89-3]
U21  AP331A  [SOT23-5]

### Nets
3.3VCC: C24.1 R33.2 TP47.1 U8.4(VOUT)
5V0_AUX: C200.2 C201.2 R102.2 R115.2 R157.2 TP7.TP U19.2(Vs) U20.1(OUT)
5V-MOT: FB22.2 TP3.TP
+5VCC: C34.1 C168.2 C198.1 FB22.1 J21.1 R148.2 TP4.TP TP36.1 U8.1(EN) U8.3(VIN) U19.8(IN-)
FGND: C12.1 C67.1 D5.A H1.1 H2.1 H3.1 H5.1 H6.1 H7.1 R3.1 R4.1 R13.2 R32.1 R66.1 R131.1 R132.1 TP68.1
GND: C4.1 C5.1 C6.1 C7.1 C12.2 C13.2 C15.2 C16.1 C24.2 C25.2 C26.2 C34.2 C35.2 C36.2 C38.1 C67.2 C71.1 C93.1 C94.2 C95.2 C151.1 C168.1 C170.1 C171.1 C199.2 C200.1 C201.1 C202.2 C203.2 C210.2 D2.A(ANODE) D5.C D22.A D23.C D43.A H4.1 J3.2 J3.4 J3.6 J21.2 J21.4 P1.2 P1.4 P1.6 P1.8 R2.1 R3.2 R4.2 R5.1 R10.1 R13.1 R32.2 R66.2 R119.1 R131.2 R132.2 R155.1 R158.1 TP45.1 TP51.1 U1.7(GND) U1.9(PAD) U8.2(GND) U8.7(PAD) U19.9(GND) U20.2(GND) U21.2(GND)
VBED: C13.1 C15.1 C16.2 C210.1 F1.2 TP43.1
VMOT: C93.2 C94.1 C95.1 C170.2 D43.K F3.2 J21.3 R154.1 TP79.1
VPWR: C6.2 C7.2 C25.1 C35.1 C36.1 C38.2 C71.2 C199.1 C202.1 C203.1 D22.K F2.2 P1.1 P1.3 P1.5 P1.7 R11.2 TP46.1 U1.2(VIN) U20.3(IN) U21.5(VCC)
VBED_IN: F1.1 J3.5 TP44.1
VMOT_IN: F3.1 J3.1 TP57.1
VPWR_IN: F2.1 J3.3 TP48.1
NetC1_1: C1.1 U1.1(BOOT)
NetC1_2: C1.2 D2.K(CATHODE) L1.1 U1.8(PH)
NetC3_1: C3.1 R1.2 R5.2 U1.5(VSNS)
NetC3_2: C3.2 C4.2 C5.2 C198.2 L1.2 R1.1 R148.1 U19.1(IN+)
NetC26_1: C26.1 U8.6(BYP)
NetC150_1: C150.1 R10.2
NetC150_2: C150.2 C151.2 U1.6(COMP)
NetC171_2: C171.2 U1.4(SS)
NetD23_A: D23.A R33.1
NetR2_2: R2.2 R11.1 R156.1 TP69.TP U1.3(EN) U19.3(nALERT) U21.4(OUT)
NetR102_1: R102.1 U19.4(RESET)
NetR115_1: R115.1 R119.2 U19.5(CMPREF)
NetR154_2: R154.2 R155.2 R156.2 U21.3(IN+)
NetR157_1: R157.1 R158.2 U21.1(IN-)
NetU19_6: U19.6(CMPIN) U19.7(VOUT)

Not connected (* = marked no-connect by the designer): U8 5(ADJ)*

### Layout directives
net class PWR_INPUT: VBED, VBED_IN, VMOT, VMOT_IN, VPWR, VPWR_IN

### Notes on the sheet
- Input Compatible with 12-24VDC
- +5V DCDC Regulator (Aux)
- +3.3V DCDC Regulator
- 15A TYP.
- (near C199) x3
- HEATBED POWER
- 5A TYP.
- FANS, EXPANSION
- HEATERS, LOGIC,
- Current Limiting for 5V rail (~4A)
- (near U19) nAlert disables +5V DC Regulator
- MOTORS
- RESET=1=LATCHING
- (near U19) RESET=0=TRANSPARENT
- (near C1) +5V DCDC Regulator
- x2
- (near J21) PWR EXP
- Can be populated to test different grounding methods
- Labels drawn without touching a wire or pin: VBED, VBED_IN, VMOT, VMOT_IN, VPWR, VPWR_IN
- (in symbol Net-Tie 0402) Net Tie
- (in symbol OSHW LOGO 8x150) OSHW PCB LOGO

### Library data of the parts
C1 = 100nF 0603 50V X7R: CAP CER 0603 100nF 50V 10% X7R; MANUFACTURER: Kemet; MANUFACTURER #: C0603C104K5RACTU; PART DESCRIPTION: 0.1µF ±10% 50V Ceramic Capacitor X7R 0603 (1608 Metric); TOLERANCE: +/- 10%; EE_SPEC: 100nF 50V X7R 0603; DISTRIBUTOR #: 399-5089-2-ND; DISTRIBUTOR: Digi-Key; PART: 100nF; VALUE: 100nF
C3 = 10pF 0402 50V NP0: CAP CER 10PF 50V 5% NP0 0402; PART DESCRIPTION: 10pF ±5% 50V Ceramic Capacitor C0G, NP0 0402 (1005 Metric); MANUFACTURER #: CL05C100JB5NNNC; MANUFACTURER: Samsung; PART: 10pF 50V NP0 0402; TOLERANCE: 5%; EE_SPEC: 50V; DISTRIBUTOR #: 1276-1139-2-ND; DISTRIBUTOR: Digikey; DNI: DNI; VALUE: 10pF
C4 C5 = 47uF 1210 10V X5R: CAP CER 47UF 10V X5R 1210; MANUFACTURER: Murata; MANUFACTURER #: GRM32ER61A476KE20L; PART DESCRIPTION: 47µF ±10% 10V Ceramic Capacitor X5R 1210 (3225 Metric); TOLERANCE: 10%; EE_SPEC: 10V, 3mOhm; DISTRIBUTOR #: 490-3887-1-ND; DISTRIBUTOR: Digikey; PART: 47uF; VALUE: 47uF
C6 C7 = 4.7uF 1210 50V X7R: CAP CER 4.7UF 50V X7R 1210; MANUFACTURER: Murata; MANUFACTURER #: GRM32ER71H475KA88L; PART DESCRIPTION: 4.7µF ±10% 50V Ceramic Capacitor X7R 1210 (3225 Metric); TOLERANCE: 10%; DISTRIBUTOR #: 490-1864-1-ND; DISTRIBUTOR: Digikey; PART: 4.7uF 1210 50V X7R; EE_SPEC: 50V; VALUE: 4.7uF
C12 C67 C198 = C0402TBD: Capacitor Non Polarized; MANUFACTURER #: DNI-C0402TBD; VALUE: C0402TBD; DNI: DNI
C13 C35 C94 = CAP 1nF 50V 0402 X7R: as C61 on sheet Motor-Z; VALUE: 1nF; DISTRIBUTOR #: 490-1303-2-ND; DISTRIBUTOR: Digi-Key Electronics; EE_SPEC: 50V
C15 C36 C95 = C0603C104K5RACTU: CAP CER 0603 100nF 50V 10% X7R; MANUFACTURER: Kemet; PART: 100nF 50V X7R 0603; PART DESCRIPTION: 0.10µF ±10% 50V Ceramic Capacitor X7R 0603 (1608 Metric); VALUE: 100nF; MANUFACTURER #: C0603C104K5RACTU; DISTRIBUTOR #: 399-5089-2-ND; DISTRIBUTOR: Digi-Key Electronics; TOLERANCE: 10%; EE_SPEC: 100nF 50V X7R 0603
C16 C38 C93 = 10uF 1206 50V X5R: CAP CER 10UF 50V 10% X5R 1206; MANUFACTURER: Murata; MANUFACTURER #: 490-10756-2-ND; PART: CAP CER 10UF 50V X5R 1206; PART DESCRIPTION: 10µF ±20% 50V Ceramic Capacitor X5R 1206 (3216 Metric); MANUFACTURER2#: 587-3248-2-ND; DISTRIBUTOR #: 490-10756-2-ND; DISTRIBUTOR: Digi-Key Electronics; TOLERANCE: 10%; EE_SPEC: 50V; VALUE: 10uF
C24 C34 = GRM155R60J105KE19D: as C185 on sheet Motor-Z; VALUE: 1uF; MANUFACTURER #: GRM155R60J105KE19D; DISTRIBUTOR #: 490-1320-2-ND; DISTRIBUTOR: Digi-Key Electronics; TOLERANCE: 10%; EE_SPEC: 1uF 6.3V X5R 0402
C25 C210 = UWT1V101MCL1GS: CAP ALUM 100UF 35V 20% SMD; MANUFACTURER: Nichicon; PART: 100uF 35V SMD Al-El; PART DESCRIPTION: 100µF 35V Aluminum Capacitors Radial, Can - SMD 1000 Hrs @ 105°C; EE_SPEC: 100uF 35V Al-El; MANUFACTURER #: UWT1V101MCL1GS; DISTRIBUTOR #: 493-2203-2-ND; DISTRIBUTOR: Digi-Key Electronics; TOLERANCE: 20%
C26 C168 C170 C200 C201 = GRM155R71C104KA88D: CAP CER 0402 100nF 16V 10% X7R; MANUFACTURER: Murata; PART: 0.1uF 16V X7R 0402; PART DESCRIPTION: 0.10µF ±10% 16V Ceramic Capacitor X7R 0402 (1005 Metric); EE_SPEC: 100nF 16V X7R 0402; VALUE: 100nF; MANUFACTURER #: GRM155R71C104KA88D; DISTRIBUTOR #: 490-3261-2-ND; DISTRIBUTOR: Digi-Key Electronics; TOLERANCE: 10%
C71 C171 = 10nF 0402 50V X7R: CAP CER 10nF 50V X7R 0402; PART DESCRIPTION: 10000pF ±5% 50V Ceramic Capacitor X7R 0402 (1005 Metric); MANUFACTURER #: GRM155R71H103JA88D; MANUFACTURER: Murata; TOLERANCE: 5%; EE_SPEC: 50V; DISTRIBUTOR #: 490-7763-1-ND; DISTRIBUTOR: Digikey; PART: 10nF 50V X7R 0402; VALUE: 10nF
C150 = 2.2nF 25V C0G 0402: CAP CER 0402 2.2nF 25V C0G; MANUFACTURER: Kemet; MANUFACTURER #: C0402C222J3GACTU; PART DESCRIPTION: 2200pF ±5% 25V Ceramic Capacitor C0G, NP0 0402 (1005 Metric); EE_SPEC: 25; TOLERANCE: 5%; VALUE: 2.2nF; DISTRIBUTOR #: 399-8957-2-ND; DISTRIBUTOR: Digikey; PART: 2.2nF 25V C0G 0402
C151 = 22pF 0402 50V C0G: CAP CER 0402 22pF 50V 5% C0G; Manufacturer: AVX; MANUFACTURER #: 04025A220JAT2A; Part Description: 22pF ±5% 50V Ceramic Capacitor C0G, NP0 0402 (1005 Metric); EE_SPEC: 22pF 5% 50V NP0 0402; VALUE: 22pF; DISTRIBUTOR #: 478-1074-2-ND; DISTRIBUTOR: Digi-Key; PART: 22pF 50V; Tolerance: 5%
C199 C202 C203 = C0603C104K5RACTU: as C189-C191 on sheet Motor-Z; VALUE: 100nF; MANUFACTURER #: C0603C104K5RACTU; DISTRIBUTOR #: 399-5089-2-ND; DISTRIBUTOR: Digi-Key Electronics; PART: 100nF 50V X7R 0603; Tolerance: 10%
D2 = SK54B: DIODE SCHOTTKY 40V 5A SMB_DO214AA; MANUFACTURER: MCC; MANUFACTURER #: SK54B-LTP; VOLTAGE: 40Vrb; PART: SK54B; DISTRIBUTOR: DIGI-KEY; DISTRIBUTOR #: SK54B-LTPMSTR-ND
D5 = RSB39VTE-17: DIODE TVS; MANUFACTURER: Rohm; PART: TVS DIODE 30VWM SOD323; TOLERANCE: -NA-; VALUE: 30V; EE_SPEC: 30Vso 30pF; MANUFACTURER #: RSB39VTE-17; DISTRIBUTOR #: RSB39VTE-17TR-ND; DISTRIBUTOR: Digi-Key Electronics; PART DESCRIPTION: TVS DIODE 30VWM SOD323
D22 D43 = SMAJ24A: TVS DIODE 24V 38.9V SMA; Manufacturer: Bourns Inc; EE_SPEC: 24Vrs 38.9Vc; MANUFACTURER #: SMAJ24A; DISTRIBUTOR #: SMAJ24ABTR-ND; DISTRIBUTOR: Digi-Key; Part Description: TVS DIODE 24V 38.9V SMA; VALUE: SMAJ24A
D23 = 5988170107F: LED 0805 Green; MANUFACTURER: Dialight; PART: LED GREEN CLEAR 0805 SMD; PART DESCRIPTION: Green 566nm LED Indication - Discrete 2V 0805 (2012 Metric); TOLERANCE: -NA-; EE_SPEC: Vf=2V; VALUE: GRN; MANUFACTURER #: 5988170107F; DISTRIBUTOR #: 350-2044-2-ND; DISTRIBUTOR: Digi-Key Electronics
F1-F3 = 3557-2: FUSE PTH ATO; MANUFACTURER: Keystone; PART: Fuse Holder; PART DESCRIPTION: Fuse Block 30A 500V 1 Circuit Blade PCB; TOLERANCE: -NA-; VALUE: -NA-; EE_SPEC: 500V; MANUFACTURER #: 3557-2; DISTRIBUTOR #: 36-3557-2-ND; DISTRIBUTOR: Digi-Key Electronics
FB22 = FERRITE 120R 3A 0603: as FB5-FB8 on sheet Motor-Z; DISTRIBUTOR #: 1276-6351-2-ND; DISTRIBUTOR: Digi-Key Electronics; PART: FERRITE 120R 3A 0603; PART DESCRIPTION: FERRITE BEAD 120 OHM 0603 1LN
H1 H2 H6 H7 = Hole_DS: MANUFACTURER #: NOTAPART-Hole
H3-H5 = Standoff3TopConn: Mechanical - Top connect; MANUFACTURER #: NOTAPART-Hole
J3 = MSTBH6: PHOENIX; MANUFACTURER: Molex; MANUFACTURER #: 39532-1006; PART: 6 Pin Conn RA; PART DESCRIPTION: 6 Position Terminal Block Header, Male Pins, Shrouded (4 Side) 0.200" (5.08mm) 90°, Right Angle Through Hole; TOLERANCE: -NA-; VALUE: HDR6; DISTRIBUTOR #: WM7849-ND; DISTRIBUTOR: Digi-Key Electronics; EE_SPEC: -NA-
J21 = Molex 0705430003 PIP: as J24 on sheet Motor-Z
L1 = 4.7uH 10A: FIXED IND 4.7UH 10A 15.5 MOHM; Manufacturer: Bourns; MANUFACTURER #: SRP1038A-4R7M; Part Description: 4.7µH Shielded Wirewound Inductor 10A 15.5 mOhm Max Nonstandard; EE_SPEC: Irms=10A, Isat=17A, DCR=0.016Ohms; Tolerance: +/- 20%; Value: 4.7uH; DISTRIBUTOR #: SRP1038A-4R7MTR-ND; DISTRIBUTOR: Digi-Key; PART: 4.7uH 10A
LOGO1 = OSHW LOGO 8x150: MANUFACTURER #: NOTAPART-OSHW LOGO
P1 = Header 4X2: Header, 4-Pin, Dual row; MANUFACTURER #: 2213S-08G; MANUFACTURER: Multicomp; PART: CONN 8Pin 2Row 0.1"; PART DESCRIPTION: Board-To-Board Connector, 2.54 mm, 8 Contacts, Header, 2213S Series, Through Hole, 2 Rows; TOLERANCE: -NA-; VALUE: HDR8; DISTRIBUTOR #: 08N6790; DISTRIBUTOR: Future; EE_SPEC: -NA-
R1 = 10.2k 1% 0402: RES SMD 10.2K OHM 1% 1/16W 0402; MANUFACTURER: Yageo; MANUFACTURER #: RC0402FR-0710K2L; PART DESCRIPTION: 10.2 kOhms ±1% 0.063W, 1/16W Chip Resistor 0402 (1005 Metric) Moisture Resistant Thick Film; DISTRIBUTOR #: YAG2950TR-ND; DISTRIBUTOR: Digikey; PART: 10.2k 1% 0402; TOLERANCE: 1%; EE_SPEC: 1/16W; VALUE: 10.2k
R2 = 1.4k 1% 0402: RES SMD 1.4K OHM 1% 1/16W 0402; MANUFACTURER: Stackpole; MANUFACTURER #: RMCF0402FT1K40; Part Description: 1.4 kOhms ±1% 0.063W, 1/16W Chip Resistor 0402 (1005 Metric) Automotive AEC-Q200 Thick Film; Tolerance: +/- 1%; EE_SPEC: 1.4k 1% 0402; VALUE: 1.4K
R5 = 1.96k 1% 0402: RES SMD 1.96K OHM 1% 1/16W 0402; MANUFACTURER: Yageo; MANUFACTURER #: RC0402FR-071K96L; PART DESCRIPTION: 1.96 kOhms ±1% 0.063W, 1/16W Chip Resistor 0402 (1005 Metric) Moisture Resistant Thick Film; VALUE: 1.96k; DISTRIBUTOR #: 311-1.96KLRTR-ND; DISTRIBUTOR: Digikey; EE_SPEC: 1/16W; PART: 1.96k 1% 0402; TOLERANCE: 1%
R10 = 37.4K 1% 0402: RES SMD 37.4K OHM 1% 1/16W 0402; MANUFACTURER: Yageo; MANUFACTURER #: RC0402FR-0737K4L; PART DESCRIPTION: 37.4 kOhms ±1% 0.063W, 1/16W Chip Resistor 0402 (1005 Metric) Moisture Resistant Thick Film; DISTRIBUTOR #: YAG3138CT-ND; DISTRIBUTOR: Digikey; PART: 37.4k; TOLERANCE: 1%; EE_SPEC: 1/16W; VALUE: 37.4k
R11 R119 R155 = 10k 1% 0402: as R128 on sheet Motor-Z; DISTRIBUTOR #: YAG1249TR-ND; DISTRIBUTOR: Digikey; PART: 10k 1% 0402; TOLERANCE: 1%; EE_SPEC: 1/16W; VALUE: 10K
R13 = CRCW040224R0FKED: Res Thick Film 0402 24 Ohm 1% 0.063W; MANUFACTURER: Yageo; MANUFACTURER #: RC0402FR-0724RL; PART: 24R 1% 0402; PART DESCRIPTION: 24 Ohm ±1% 0.063W, 1/16W Chip Resistor 0402 (1005 Metric) Moisture Resistant Thick Film; EE_SPEC: 1/16W; VALUE: 24R; DISTRIBUTOR #: YAG3073TR-ND; DISTRIBUTOR: Digi-Key Electronics; TOLERANCE: 1%
R33 R102 = RK73H1ETTP1001F: RES 0402 1k 63mW 1%; MANUFACTURER: Yageo; MANUFACTURER #: RC0402FR-071KL; PART: 1k 1% 0402; PART DESCRIPTION: 1k Ohm ±1% 0.063W, 1/16W Chip Resistor 0402 (1005 Metric) Moisture Resistant Thick Film; EE_SPEC: 1/16W; VALUE: 1k; DISTRIBUTOR #: 311-1.00KLRTR-ND; DISTRIBUTOR: Digi-Key Electronics; TOLERANCE: 1%
R66 = R0402TBD: Resistor; MANUFACTURER #: DNI-R0402TBD; VALUE: R0402TBD; DNI: DNI
R115 = 15K 1% 0402: RES SMD 15K 1% 1/16W 0402; MANUFACTURER: Samsung; MANUFACTURER #: RC1005F153CS; PART DESCRIPTION: 15K Ohm ±1% 0.063W, 1/16W Chip Resistor 0402 (1005 Metric) Moisture Resistant Thick Film; DISTRIBUTOR #: 1276-3442-2-ND; DISTRIBUTOR: Digikey; PART: 15K 1% 0402; TOLERANCE: 1%; EE_SPEC: 1/16W; VALUE: 15K
R148 = 0.01R 1% 0805: RES 0.01 OHM 1% 1/2W 0805; MANUFACTURER: Susumu; MANUFACTURER #: KRL1220E-M-R010-F-T5; PART: 0.01 1% 0.5W 0805; PART DESCRIPTION: 10 mOhms ±1% 0.5W, 1/2W Chip Resistor 0805 (2012 Metric) Automotive AEC-Q200, Current Sense Metal Foil; EE_SPEC: 0.5W; DISTRIBUTOR #: 408-1544-2-ND; DISTRIBUTOR: Digikey; TOLERANCE: 1%; VALUE: 0.01R
R154 = 24k 1% 0402: RES SMD 24K OHM 1% 1/16W 0402; MANUFACTURER: Visha Dale; MANUFACTURER #: CRCW040224K0FKEDC; Part Description: 24 kOhms ±1% 0.063W, 1/16W Chip Resistor 0402 (1005 Metric)  Thick Film; Tolerance: +/- 1%; EE_SPEC: 24k 1% 0402; VALUE: 24K
R156 = 1M 5% 0402: RES 0402 1M 100mW 5%; MANUFACTURER: Panasonic; MANUFACTURER #: ERJ2GEJ105X; PART DESCRIPTION: 1M Ohm ±5% 0.1W, 1/10W Chip Resistor 0402 (1005 Metric) Automotive AEC-Q200 Thick Film; EE_SPEC: 1/10W; DISTRIBUTOR #: P1.0MJTR-ND; DISTRIBUTOR: Digikey; PART: 1M 5% 0402; TOLERANCE: 5%; VALUE: 1M
R157 = 130k 1% 0402: RES SMD 130K OHM 5% 1/16W 0402; MANUFACTURER: Yageo; MANUFACTURER #: RC0402JR-07130KL; PART DESCRIPTION: 130 kOhms ±5% 0.063W, 1/16W Chip Resistor 0402 (1005 Metric) Moisture Resistant Thick Film; TOLERANCE: 1%; DISTRIBUTOR #: YAG3273CT-ND; DISTRIBUTOR: Digikey; PART: 130k 1% 0402; EE_SPEC: 1/16W; VALUE: 130k
R158 = 100k 1% 0402: RES SMD 100K OHM 1% 1/16W 0402; MANUFACTURER: Samsung; MANUFACTURER #: RC1005F104CS; PART DESCRIPTION: 100k Ohm ±1% 0.063W, 1/16W Chip Resistor 0402 (1005 Metric) Moisture Resistant Thick Film; DISTRIBUTOR #: 1276-3432-1-ND; DISTRIBUTOR: Digikey; PART: 100k 1% 0402; TOLERANCE: 1%; EE_SPEC: 1/16W; VALUE: 100K
TP3 TP4 TP7 TP69 = TestPoint: Test Point
TP36 TP43-TP48 TP51 TP57 TP68 TP79 = Socket: MANUFACTURER #: NOTAPART-Testpoint
U1 = TPS54531: IC REG BUCK ADJ 5A 8SOPWRPAD; MANUFACTURER #: TPS54531DDAR; MANUFACTURER: TI; PART DESCRIPTION: Buck Switching Regulator IC Positive Adjustable 0.8V 1 Output 5A 8-PowerSOIC (0.154", 3.90mm Width); EE_SPEC: 28Vin_max, 5A, 570kHz; VALUE: TPS54531; DISTRIBUTOR #: 296-40801-2-ND; DISTRIBUTOR: Digikey; PART: TPS54531
U8 = MIC5353-3.3YMT-TR: LDO 3.3V 500mA - low ESR Cout; MANUFACTURER: Microchip; PART: IC REG LDO 3.3V 0.5A 6TMLF; PART DESCRIPTION: Linear Voltage Regulator IC Positive Fixed 1 Output 3.3V 500mA 6-TMLF® (1.6x1.6); TOLERANCE: -NA-; VALUE: 3.3V LDO; MANUFACTURER #: MIC5353-3.3YMT-TR; DISTRIBUTOR #: 576-3680-2-ND; DISTRIBUTOR: Digi-Key Electronics; EE_SPEC: 500mA
U19 = INA381_ALT: IC COMPARATOR BIDIR 8WSON; MANUFACTURER #: INA381A2IDSGR; MANUFACTURER: TI; TOLERANCE: -NA-; EE_SPEC: Vcc 2.7-5.5V; Vcm 26V; DISTRIBUTOR #: 296-49078-2-ND; DISTRIBUTOR: Digikey; PART: INA381A2; VALUE: INA381A2
U20 = 78L05: IC REG LINEAR 5V 100MA SOT89-3; MANUFACTURER #: L78L05ABUTR; MANUFACTURER: ST; PART DESCRIPTION: Linear Voltage Regulator IC Positive Fixed 1 Output 5V 100mA SOT-89-3; TOLERANCE: -NA-; VALUE: 5V LDO; EE_SPEC: Vin 30V, Iout 0.1A; DISTRIBUTOR #: 497-1181-2-ND; DISTRIBUTOR: Digikey; PART: IC REG LINEAR 5V 100MA SOT89-3
U21 = AP331A: IC QUAD DIFF COMPARATOR 14 -SOIC; MANUFACTURER: TEXAS INSTRUMENTS; MANUFACTURER #: AP331AWG-7; PART: AP331A; DISTRIBUTOR: DIGI-KEY; DISTRIBUTOR #: AP331AWGDITR-ND; VALUE: AP331A

## Sheet Thermistors.SchDoc: Thermistors
size Letter; DocumentNumber: 6; SheetNumber: 10; SheetTotal: 11
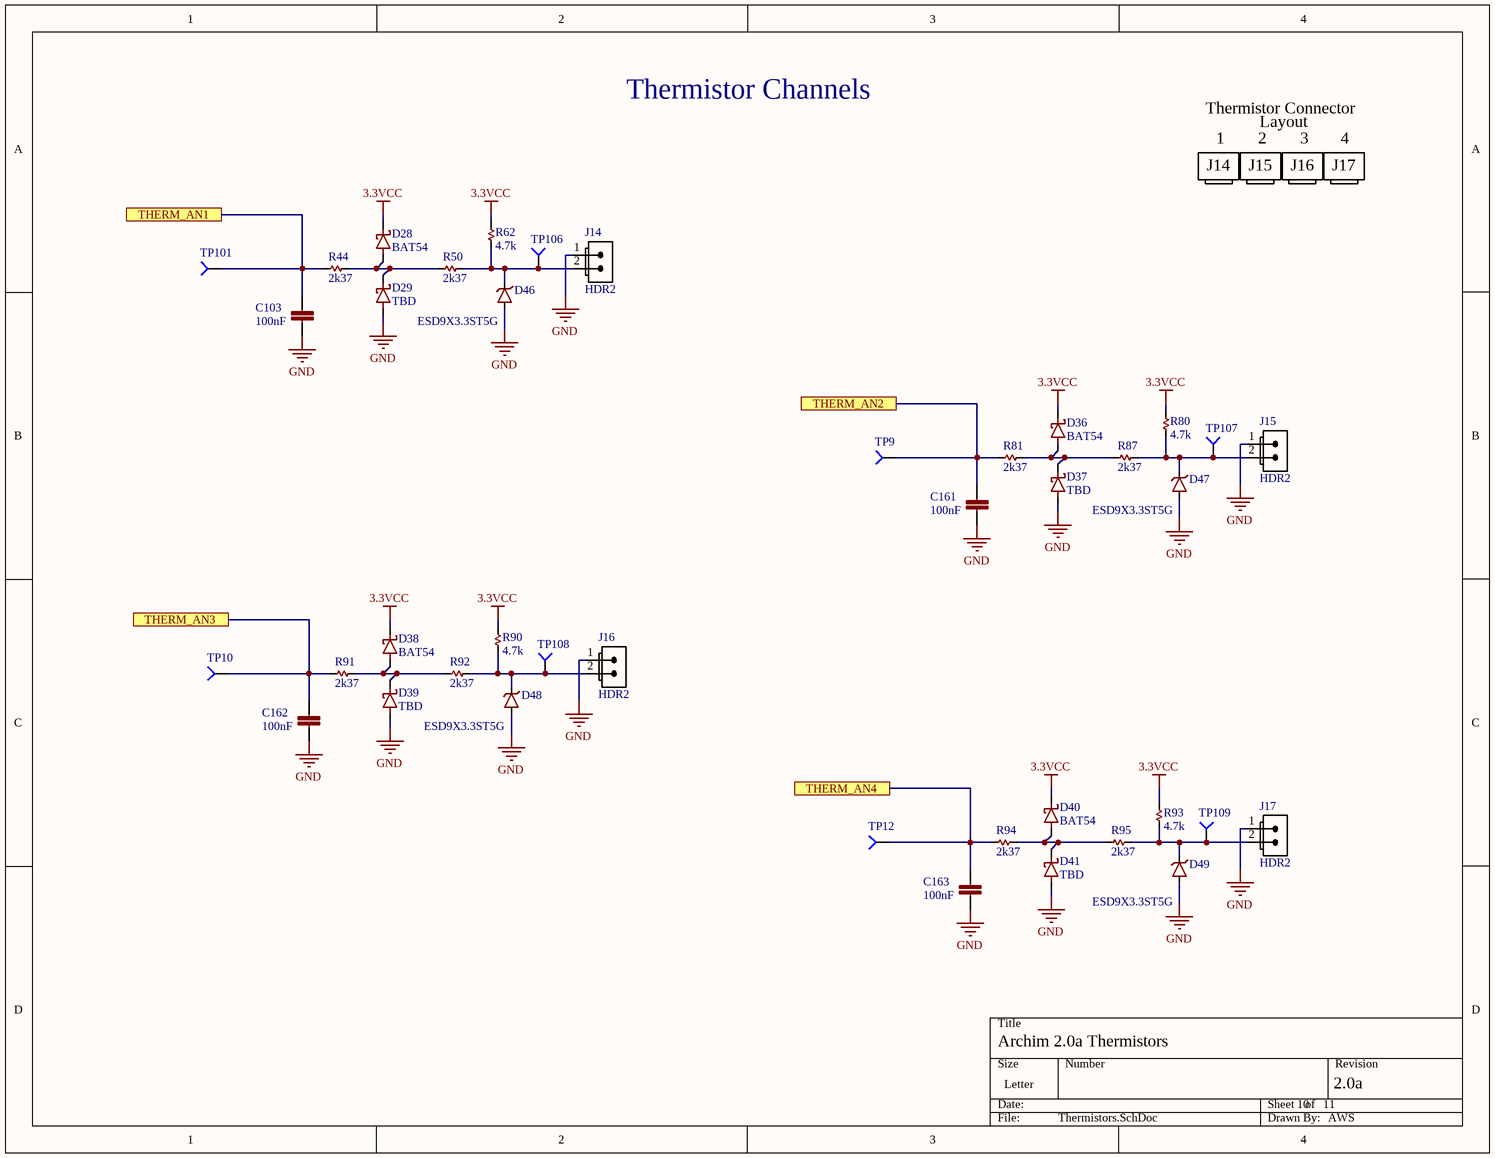
[diagram p10: Thermistors.SchDoc]

### Parts
C103  100nF  [C0402]
C161  100nF  [C0402]
C162  100nF  [C0402]
C163  100nF  [C0402]
D28  BAT54  [SOD523_IPC]
D29  TBD  [SOD523_IPC]
D36  BAT54  [SOD523_IPC]
D37  TBD  [SOD523_IPC]
D38  BAT54  [SOD523_IPC]
D39  TBD  [SOD523_IPC]
D40  BAT54  [SOD523_IPC]
D41  TBD  [SOD523_IPC]
D46  ESD9X3.3ST5G  [SOD923-D]
D47  ESD9X3.3ST5G  [SOD923-D]
D48  ESD9X3.3ST5G  [SOD923-D]
D49  ESD9X3.3ST5G  [SOD923-D]
J14  value HDR2  [70543-01 PIN-IN-PASTE]  (hidden comment: CONN 2PIN VERT 0.1" SHRD LOCKING PIP)
J15  value HDR2  [70543-01 PIN-IN-PASTE]  (hidden comment: CONN 2PIN VERT 0.1" SHRD LOCKING PIP)
J16  value HDR2  [70543-01 PIN-IN-PASTE]  (hidden comment: CONN 2PIN VERT 0.1" SHRD LOCKING PIP)
J17  value HDR2  [70543-01 PIN-IN-PASTE]  (hidden comment: CONN 2PIN VERT 0.1" SHRD LOCKING PIP)
R44  2k37  [R0402]
R50  2k37  [R0402]
R62  4.7k  [R0402]
R80  4.7k  [R0402]
R81  2k37  [R0402]
R87  2k37  [R0402]
R90  4.7k  [R0402]
R91  2k37  [R0402]
R92  2k37  [R0402]
R93  4.7k  [R0402]
R94  2k37  [R0402]
R95  2k37  [R0402]
TP9  TP4  [TP-2]  (value not drawn)  (no BOM)
TP10  TP4  [TP-2]  (value not drawn)  (no BOM)
TP12  TP4  [TP-2]  (value not drawn)  (no BOM)
TP101  TP4  [TP-2]  (value not drawn)  (no BOM)
TP106  TP4  [TP-2]  (value not drawn)  (no BOM)
TP107  TP4  [TP-2]  (value not drawn)  (no BOM)
TP108  TP4  [TP-2]  (value not drawn)  (no BOM)
TP109  TP4  [TP-2]  (value not drawn)  (no BOM)

### Ports
THERM_AN1, THERM_AN2, THERM_AN3, THERM_AN4

### Nets
3.3VCC: D28.K D36.K D38.K D40.K R62.2 R80.2 R90.2 R93.2
GND: C103.2 C161.2 C162.2 C163.2 D29.A D37.A D39.A D41.A D46.A D47.A D48.A D49.A J14.1(S) J15.1(S) J16.1(S) J17.1(S)
THERM_AN1: C103.1 R44.1 TP101.1 ; port THERM_AN1
THERM_AN2: C161.1 R81.1 TP9.1 ; port THERM_AN2
THERM_AN3: C162.1 R91.1 TP10.1 ; port THERM_AN3
THERM_AN4: C163.1 R94.1 TP12.1 ; port THERM_AN4
NetD28_A: D28.A D29.K R44.2 R50.1
NetD36_A: D36.A D37.K R81.2 R87.1
NetD38_A: D38.A D39.K R91.2 R92.1
NetD40_A: D40.A D41.K R94.2 R95.1
NetD46_K: D46.K J14.2(S) R50.2 R62.1 TP106.1
NetD47_K: D47.K J15.2(S) R80.1 R87.2 TP107.1
NetD48_K: D48.K J16.2(S) R90.1 R92.2 TP108.1
NetD49_K: D49.K J17.2(S) R93.1 R95.2 TP109.1

### Notes on the sheet
- Thermistor Channels
- Thermistor Connector
- 1
- 2
- Layout
- 3
- 4
- J14
- J15
- J16
- J17

### Library data of the parts
C103 C161-C163 = GRM155R71C104KA88D: as C26 on sheet Power; VALUE: 100nF; MANUFACTURER #: GRM155R71C104KA88D; DISTRIBUTOR #: 490-3261-2-ND; DISTRIBUTOR: Digi-Key Electronics; TOLERANCE: 10%
D28 D36 D38 D40 = BAT54WX: DIODE SCHOTTKY 30V 200MA SOD523; MANUFACTURER: Diodes Incorporated; MANUFACTURER #: BAT54WX-TP; PART: Schottky Diode; PART DESCRIPTION: Diode Schottky 30V 200mA (DC) Surface Mount SOD-523; TOLERANCE: -NA-; VALUE: BAT54; DISTRIBUTOR #: BAT54WX-TPTR-ND; DISTRIBUTOR: Digi-Key Electronics; EE_SPEC: 30V 200mA
D29 D37 D39 D41 = SOD523_TBD: TOLERANCE: -NA-; MANUFACTURER: TBD; VALUE: TBD; MANUFACTURER #: TBD; EE_SPEC: TBD
D46-D49 = ESD9X3.3ST5G: TVS DIODE 3.3VWM 10.4VC SOD923; MANUFACTURER: On Semi; PART DESCRIPTION: TVS DIODE 3.3VWM SOD923; TOLERANCE: -NA-; VALUE: 3.3V; EE_SPEC: 3.3Vso 15pF; MANUFACTURER #: ESD9X3.3ST5G; DISTRIBUTOR #: ESD9X3.3ST5GOSCT-ND; DISTRIBUTOR: Digikey
J14-J17 = CONN 2PIN VERT 0.1" SHRD LOCKING PIP: Connector 2pos - Pin in Paste; MANUFACTURER: Molex; MANUFACTURER #: 0705430001; PART: 2 Pin Conn; PART DESCRIPTION: 2 Positions Header, Shrouded Connector 0.100" (2.54mm) Through Hole Gold; TOLERANCE: -NA-; DISTRIBUTOR #: WM4800-ND; DISTRIBUTOR: Digikey; EE_SPEC: -NA-
R44 R50 R81 R87 R91 R92 R94 R95 = RC0402FR-072K37L: RES SMD 2.37K OHM 1% 1/16W 0402; MANUFACTURER: Yageo; PART: 2.37k 1% 0402; PART DESCRIPTION: 2.37k Ohm ±1% 0.063W, 1/16W Chip Resistor 0402 (1005 Metric) Moisture Resistant Thick Film; VALUE: 2k37; MANUFACTURER #: RC0402FR-072K37L; DISTRIBUTOR #: 311-2.37KLRTR-ND; DISTRIBUTOR: Digi-Key Electronics; TOLERANCE: 1%; EE_SPEC: 1/16W
R62 R80 R90 R93 = RC0402FR-074K7L: RES SMD 4.7K OHM 1% 1/16W 0402; MANUFACTURER: YAGEO; PART: 4.7k 1% 0402; PART DESCRIPTION: 4.7k Ohm ±1% 0.063W, 1/16W Chip Resistor 0402 (1005 Metric) Moisture Resistant Thick Film; VALUE: 4.7k; MANUFACTURER #: RC0402FR-074K7L; DISTRIBUTOR #: 311-4.7KLRTR-ND; DISTRIBUTOR: Digi-Key Electronics; TOLERANCE: 1%; EE_SPEC: 1/16W
TP9 TP10 TP12 TP101 TP106-TP109 = Socket: MANUFACTURER #: NOTAPART-Testpoint